# EAGLE design kawa_devboard (EAGLE 9.6.2)
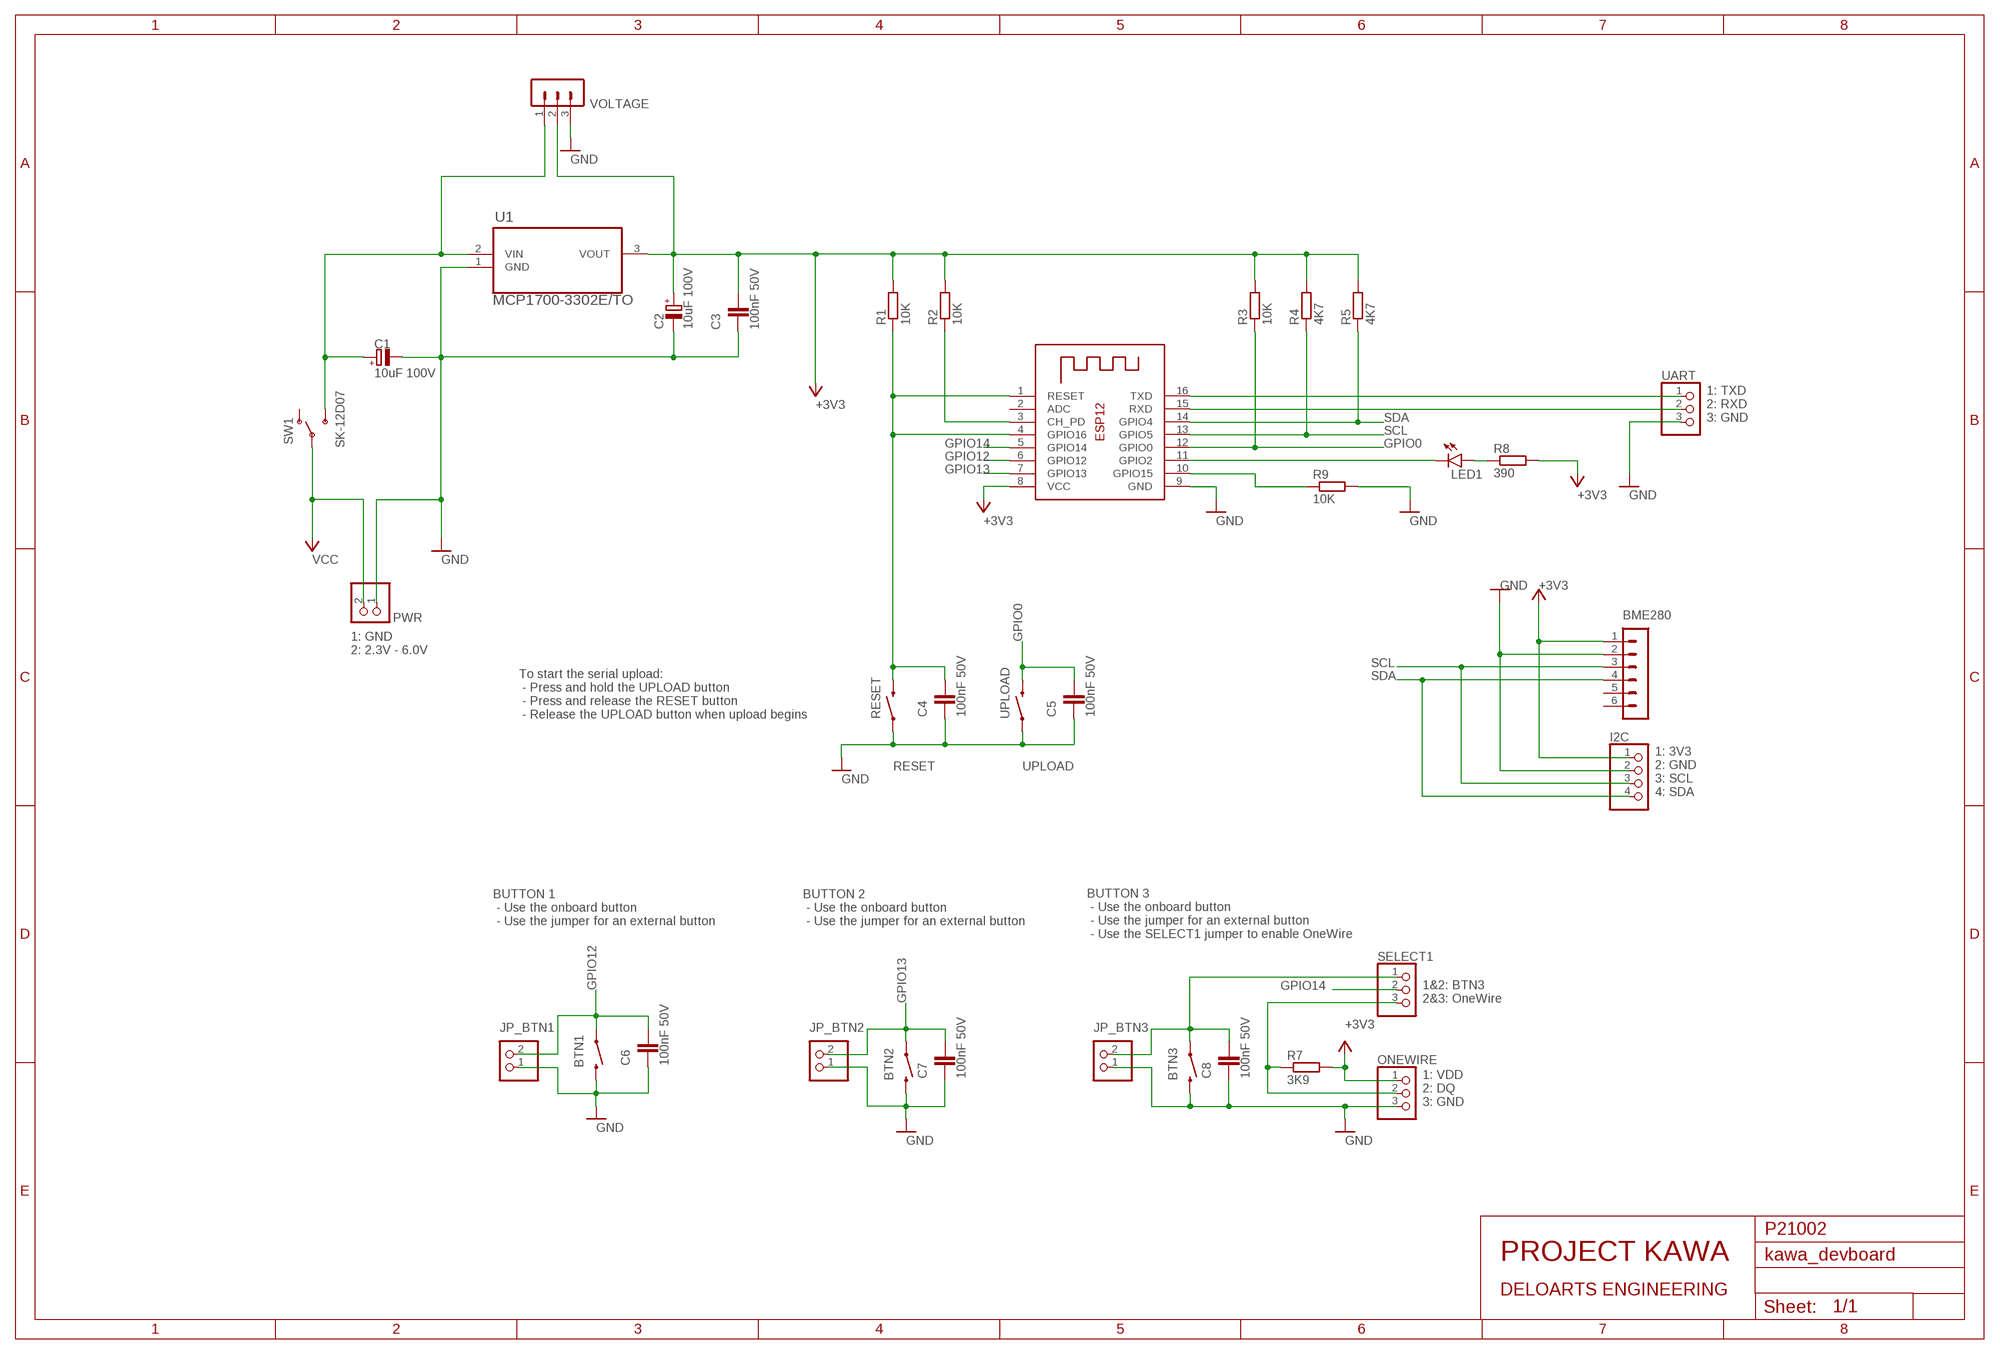
[diagram p0: schematic, sheet 1]

## Parts
BME280  MA06-1  [MA06-1]
BTN1  MOMENTARY-SWITCH-SPST-PTH-6.0MM  [TACTILE_SWITCH_PTH_6.0MM]
BTN2  MOMENTARY-SWITCH-SPST-PTH-6.0MM  [TACTILE_SWITCH_PTH_6.0MM]
BTN3  MOMENTARY-SWITCH-SPST-PTH-6.0MM  [TACTILE_SWITCH_PTH_6.0MM]
C1  10uF 100V  CPOL-EUE2-5  [E2-5]
C2  10uF 100V  CPOL-EUE2-5  [E2-5]
C3  100nF 50V  C2,5-3  [C2.5-3]
C4  100nF 50V  C2,5-3  [C2.5-3]
C5  100nF 50V  C2,5-3  [C2.5-3]
C6  100nF 50V  C2,5-3  [C2.5-3]
C7  100nF 50V  C2,5-3  [C2.5-3]
C8  100nF 50V  C2,5-3  [C2.5-3]
I2C  PINHD-1X4  [1X04]
JP_BTN1  PINHD-1X2/90  [1X02/90]
JP_BTN2  PINHD-1X2/90  [1X02/90]
JP_BTN3  PINHD-1X2/90  [1X02/90]
LED1  LEDSFH480  [SFH480]
ONEWIRE  PINHD-1X3/90  [1X03/90]
PWR  PINHD-1X2/90  [1X02/90]
R1  10K  R-EU_0204/7  [0204/7]
R2  10K  R-EU_0204/7  [0204/7]
R3  10K  R-EU_0204/7  [0204/7]
R4  4K7  R-EU_0204/7  [0204/7]
R5  4K7  R-EU_0204/7  [0204/7]
R7  3K9  R-EU_0204/7  [0204/7]
R8  390  R-EU_0204/7  [0204/7]
R9  10K  R-EU_0204/7  [0204/7]
RESET  MOMENTARY-SWITCH-SPST-PTH-6.0MM  [TACTILE_SWITCH_PTH_6.0MM]
SELECT1  PINHD-1X3  [1X03]
SW1  SK-12D07  [SK12SWITCH]
U1  MCP1700-3302E/TO  [TO127P254X495-3]
UART  PINHD-1X3  [1X03]
UPLOAD  MOMENTARY-SWITCH-SPST-PTH-6.0MM  [TACTILE_SWITCH_PTH_6.0MM]
VOLTAGE  MA03-1  [MA03-1]
X1  ESP-12  [ESP-12]

## Nets
+3V3: BME280.1 C2.+ C3.1 I2C.1 ONEWIRE.1 R1.2 R2.2 R3.2 R4.2 R5.2 R7.2 R8.2 U1.3(VOUT) VOLTAGE.2 X1.8(VCC)
BTN3: BTN3.1 C8.1 JP_BTN3.2 SELECT1.1
CH_PD: R2.1 X1.3(CH_PD)
DQ: ONEWIRE.2 R7.1 SELECT1.3
GND: BME280.2 BTN1.3 BTN2.3 BTN3.3 C1.- C2.- C3.2 C4.2 C5.2 C6.2 C7.2 C8.2 I2C.2 JP_BTN1.1 JP_BTN2.1 JP_BTN3.1 ONEWIRE.3 PWR.1 R9.2 RESET.1 U1.1(GND) UART.3 UPLOAD.1 VOLTAGE.3 X1.9(GND)
GPIO0: C5.1 R3.1 UPLOAD.3 X1.12(GPIO0)
GPIO2: LED1.K(C) X1.11(GPIO2)
GPIO12: BTN1.1 C6.1 JP_BTN1.2 X1.6(GPIO12)
GPIO13: BTN2.1 C7.1 JP_BTN2.2 X1.7(GPIO13)
GPIO14: SELECT1.2 X1.5(GPIO14)
GPIO15: R9.1 X1.10(GPIO15)
LED1: LED1.A R8.1
RST: C4.1 R1.1 RESET.3 X1.1(RESET) X1.4(GPIO16)
RXD: UART.2 X1.15(RXD)
SCL: BME280.3 I2C.3 R4.1 X1.13(GPIO5)
SDA: BME280.4 I2C.4 R5.1 X1.14(GPIO4)
TXD: UART.1 X1.16(TXD)
VCC: PWR.2 SW1.P2(P)
VIN: C1.+ SW1.IN(S) U1.2(VIN) VOLTAGE.1
Unconnected: BME280.5 BME280.6 SW1.P1(O) X1.2(ADC)

## Notes on the sheet
- 1: TXD
  2: RXD
  3: GND
- 1: GND
  2: 2.3V - 6.0V
- To start the serial upload:
   - Press and hold the UPLOAD button
   - Press and release the RESET button
   - Release the UPLOAD button when upload begins
- RESET | UPLOAD
- 1: 3V3
  2: GND
  3: SCL
  4: SDA
- BUTTON 1
   - Use the onboard button
   - Use the jumper for an external button
- BUTTON 2
   - Use the onboard button
   - Use the jumper for an external button
- BUTTON 3
   - Use the onboard button
   - Use the jumper for an external button
   - Use the SELECT1 jumper to enable OneWire
- 1&2: BTN3
  2&3: OneWire
- 1: VDD
  2: DQ
  3: GND
- P21002
- PROJECT KAWA
- DELOARTS ENGINEERING

## Library data of the parts
BME280 = con-lstb:MA06-1: PIN HEADER; OC_FARNELL: unknown; OC_NEWARK: unknown
BTN1-BTN3 RESET UPLOAD = SparkFun-Switches:MOMENTARY-SWITCH-SPST: Momentary Switch (Pushbutton) - SPST Normally-open (NO) SPST momentary switches (buttons, pushbuttons). Variants PTH-12MM - 12mm square, through-hole Momentary Pushbutton Switch - 12mm Square <https://www.sparkfun.com/products/9190> (COM-09190) PTH-6.0MM, PTH-6.0MM-KIT - 6.0mm square, through-hole Mini Pushbutton Switch <https://www.sparkfun.com/products/97> (COM-00097) KIT package intended for soldering kit's - only one side of pads' copper is exposed. PTH-RIGHT-ANGLE-KIT - Right-angle, through-hole Right Angle Tactile Button <https://www.sparkfun.com/products/10791> - Used on SparkFun BigTime Watch Kit <https://www.sparkfun.com/products/11734> SMD-12MM - 12mm square, surface-mount Tactile Button - SMD (12mm) <https://www.sparkfun.com/products/12993> (COM-12993) Used on SparkFun PicoBoard <https://www.sparkfun.com/products/11888> SMD-4.5MM - 4.5mm Square Trackball Switch Used on SparkFun Blackberry Trackballer Breakout <https://www.sparkfun.com/products/13169> SMD-4.6MMX2.8MM - 4.60mm x 2.80mm, surface mount Used on SparkFun SAMD21 Mini Breakout <https://www.sparkfun.com/products/13664> SMD-5.2MM, SMD-5.2-REDUNDANT - 5.2mm square, surface-mount Mini Pushbutton Switch - SMD <https://www.sparkfun.com/products/8720> (COM-08720) Used on Arduino Pro Mini <https://www.sparkfun.com/products/11114> REDUNDANT package connects both switch circuits together SMD-6.0X3.5MM - 6.0 x 3.5mm, surface mount Momentary Reset Switch SMD <https://www.sparkfun.com/products/8229> (COM-08229) SMD-6.2MM-TALL - 6.2mm square, surface mount Tactile Button - SMD (6mm) <https://www.sparkfun.com/products/12992> Used on SparkFun Digital Sandbox <https://www.sparkfun.com/products/12651> SMD-RIGHT-ANGLE - Right-angle, surface mount Used on SparkFun Block for Intel® Edison - Arduino <https://www.sparkfun.com/products/13036>; PROD_ID: SWCH-08441; SF_SKU: COM-00097
C1 C2 = rcl:CPOL-EU: POLARIZED CAPACITOR, European symbol; SPICEPREFIX: C
C3-C8 = capacitor-wima:C: CAPACITOR naming: grid - package width
I2C = pinhead:PINHD-1X4: PIN HEADER
JP_BTN1-JP_BTN3 PWR = pinhead:PINHD-1X2: PIN HEADER
LED1 = led:LED: LED OSRAM: - CHIPLED LG R971, LG N971, LY N971, LG Q971, LY Q971, LO R971, LY R971 LH N974, LH R974 LS Q976, LO Q976, LY Q976 LO Q996 - Hyper CHIPLED LW Q18S LB Q993, LB Q99A, LB R99A - SideLED LS A670, LO A670, LY A670, LG A670, LP A670 LB A673, LV A673, LT A673, LW A673 LH A674 LY A675 LS A676, LA A676, LO A676, LY A676, LW A676 LS A679, LY A679, LG A679 - Hyper Micro SIDELED® LS Y876, LA Y876, LO Y876, LY Y876 LT Y87S - SmartLED LW L88C, LW L88S LB L89C, LB L89S, LG L890 LS L89K, LO L89K, LY L89K LS L896, LA L896, LO L896, LY L896 - TOPLED LS T670, LO T670, LY T670, LG T670, LP T670 LSG T670, LSP T670, LSY T670, LOP T670, LYG T670 LG T671, LOG T671, LSG T671 LB T673, LV T673, LT T673, LW T673 LH T674 LS T676, LA T676, LO T676, LY T676, LB T676, LH T676, LSB T676, LW T676 LB T67C, LV T67C, LT T67C, LS T67K, LO T67K, LY T67K, LW E67C LS E67B, LA E67B, LO E67B, LY E67B, LB E67C, LV E67C, LT E67C LW T67C LS T679, LY T679, LG T679 LS T770, LO T770, LY T770, LG T770, LP T770 LB T773, LV T773, LT T773, LW T773 LH T774 LS E675, LA E675, LY E675, LS T675 LS T776, LA T776, LO T776, LY T776, LB T776 LHGB T686 LT T68C, LB T68C - Hyper Mini TOPLED® LB M676 - Mini TOPLED Santana® LG M470 LS M47K, LO M47K, LY M47K Source: http://www.osram.convergy.de LUXEON: - LUMILED® LXK2-PW12-R00, LXK2-PW12-S00, LXK2-PW14-U00, LXK2-PW14-V00 LXK2-PM12-R00, LXK2-PM12-S00, LXK2-PM14-U00 LXK2-PE12-Q00, LXK2-PE12-R00, LXK2-PE12-S00, LXK2-PE14-T00, LXK2-PE14-U00 LXK2-PB12-K00, LXK2-PB12-L00, LXK2-PB12-M00, LXK2-PB14-N00, LXK2-PB14-P00, LXK2-PB14-Q00 LXK2-PR12-L00, LXK2-PR12-M00, LXK2-PR14-Q00, LXK2-PR14-R00 LXK2-PD12-Q00, LXK2-PD12-R00, LXK2-PD12-S00 LXK2-PH12-R00, LXK2-PH12-S00 LXK2-PL12-P00, LXK2-PL12-Q00, LXK2-PL12-R00 Source: www.luxeon.com KINGBRIGHT: KA-3528ASYC Source: www.kingbright.com
ONEWIRE SELECT1 UART = pinhead:PINHD-1X3: PIN HEADER
R1-R5 R7-R9 = rcl:R-EU_: RESISTOR, European symbol; SPICEPREFIX: R
SW1 = custom:SK-12D07
U1 = MCP1700-3302E_TO:MCP1700-3302E/TO: IC LDO REG 250MA 5.0V Check prices <https://pricing.snapeda.com/parts/MCP1700-3302E/TO/Microchip%20Technology/view-part?ref=eda>; AVAILABILITY: Good; DESCRIPTION: IC REG LINEAR 3.3V 250MA TO92-3; MF: Microchip Technology; MP: MCP1700-3302E/TO; PACKAGE: None; PRICE: None; PURCHASE-URL: https://pricing.snapeda.com/search/part/MCP1700-3302E/TO/?ref=eda
VOLTAGE = con-lstb:MA03-1: PIN HEADER; OC_FARNELL: unknown; OC_NEWARK: unknown
X1 = adafruit:ESP-12

## Board
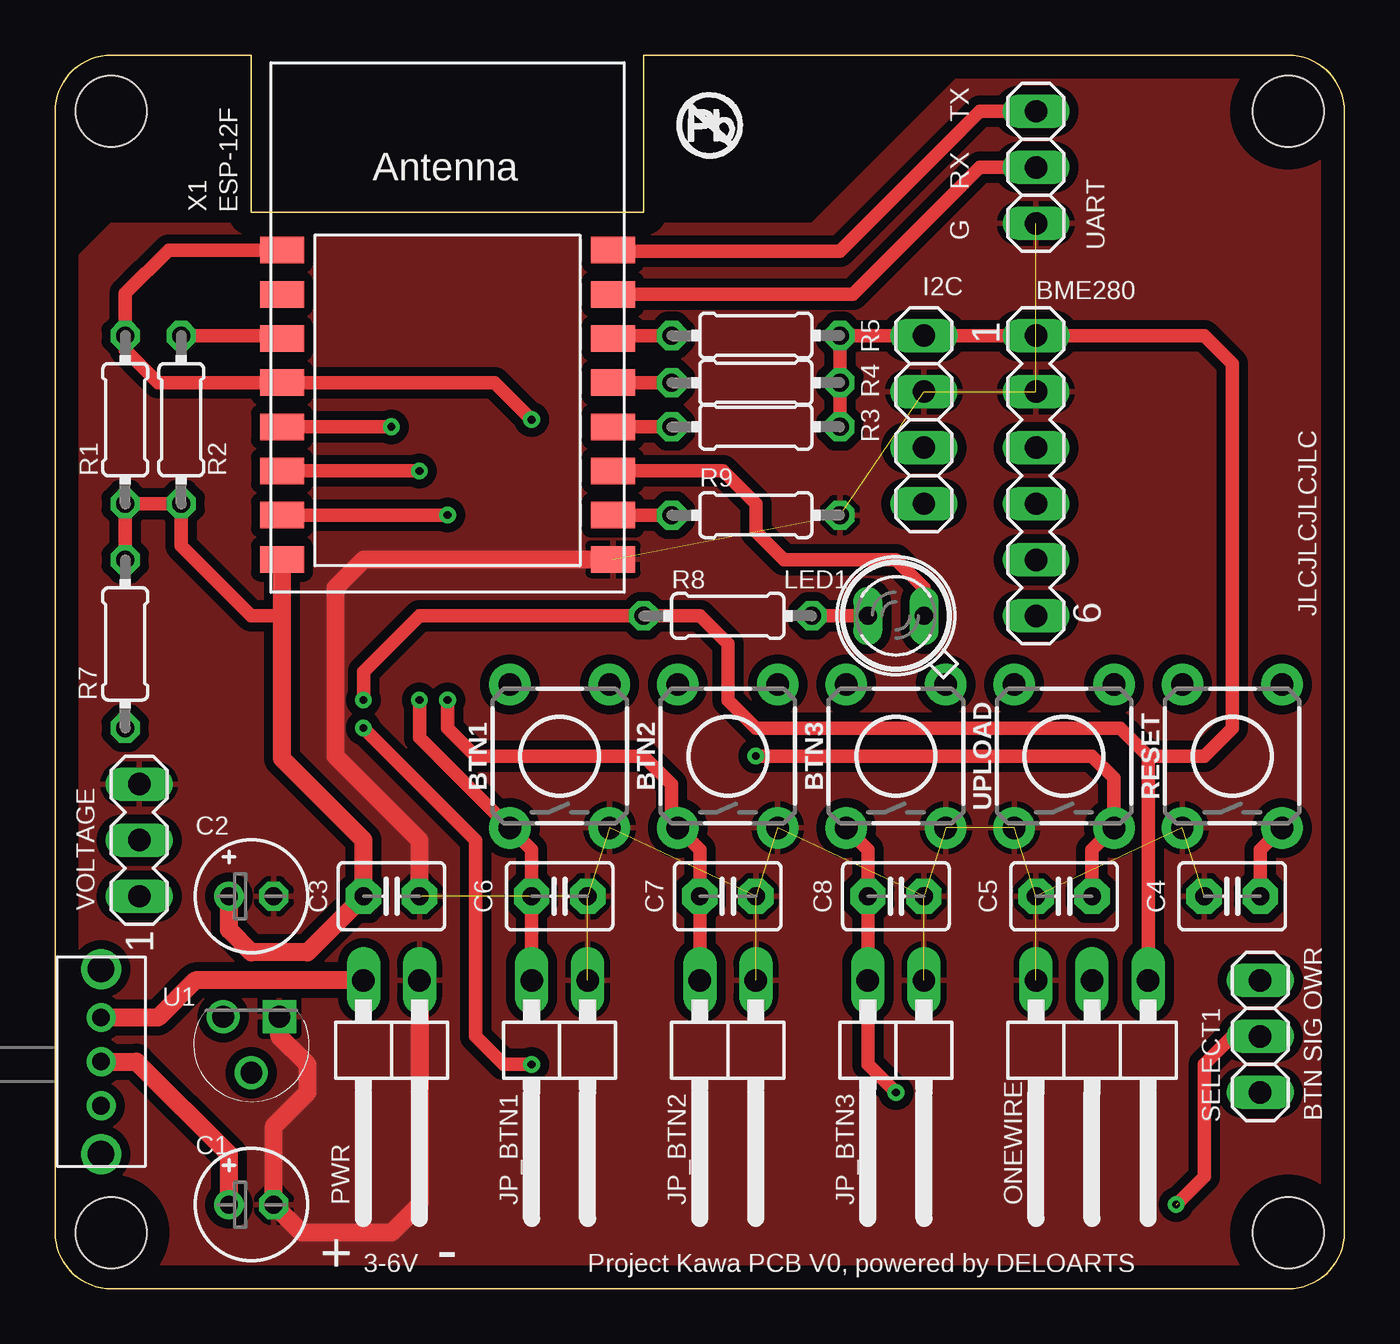
[diagram p1: board, top side]
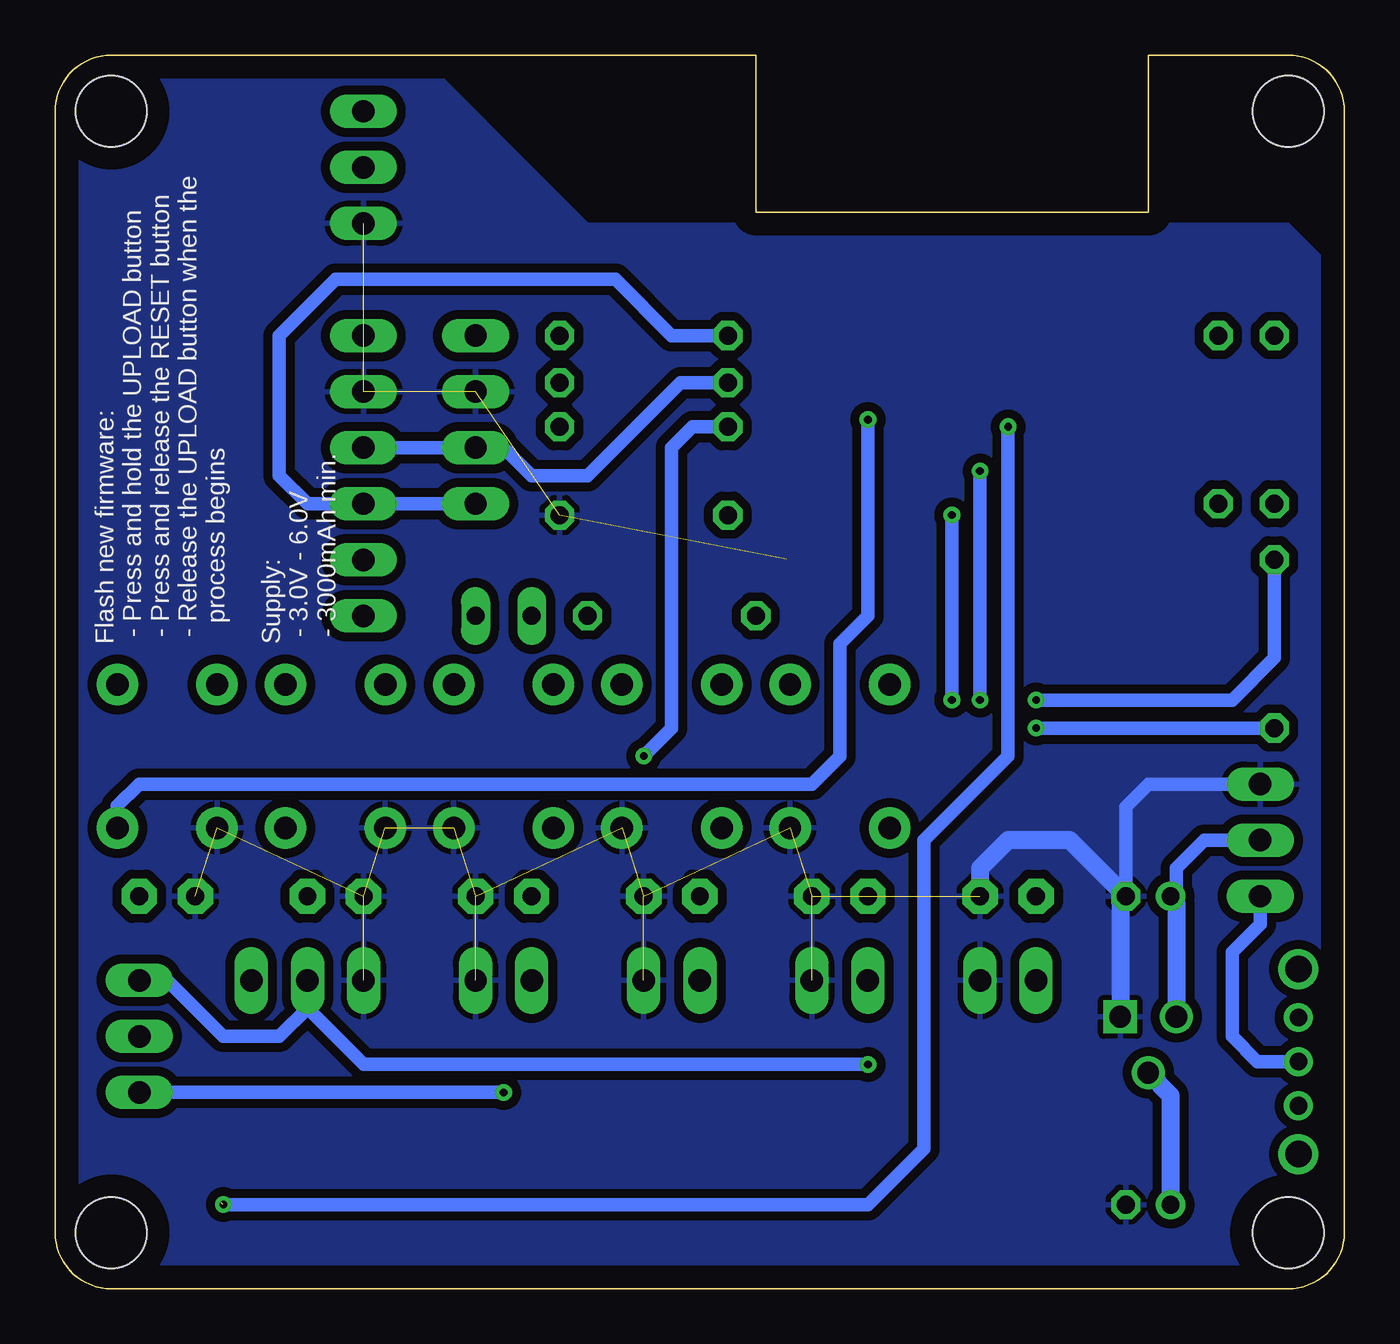
[diagram p2: board, bottom side, seen from below]

Size 58.42 x 55.88 mm. Coordinates in mm from the lower left corner, seen from the top.
Outline: 8.89,55.88 8.89,48.77 26.67,48.77 26.67,55.88 55.88,55.88 arc-90 58.42,53.34 58.42,2.54 arc-90 55.88,0 2.54,0 arc-90 0,2.54 0,53.34 arc-90 2.54,55.88 8.89,55.88
Copper layers (1*16): Top 0.035mm / dielectric 1.5mm / Bottom 0.035mm
Design rules "default": minimum track width 6mil, minimum drill 0.35mm, track to track 6mil, track to pad 6mil, pad to pad 6mil, via to via 6mil, smd to smd 6mil, copper to edge 40mil, drill to drill 6mil, minimum pad ring 10mil, minimum via ring 8mil, stop-mask expansion 4mil, vias tented up to drill 0mil, thermal gap 10mil
Holes 3.2 mm at 55.88,53.34 2.54,53.34 55.88,2.54 2.54,2.54

### Footprints (pad centres in the part's own frame; a part is rotated, then mirrored left to right if it is on the bottom)
MA06-1 = drill 1.016 long: 1 -6.35,0; 2 -3.81,0; 3 -1.27,0; 4 1.27,0; 5 3.81,0; 6 6.35,0
TACTILE_SWITCH_PTH_6.0MM = drill 1.016 pad 1.88: 1 -3.251,2.261; 2 3.251,2.261; 3 -3.251,-2.261; 4 3.251,-2.261
E2-5 = drill 0.813 pad 1.27: + -1.016,0 | drill 0.813 pad 1.27 octagon: - 1.016,0
C2.5-3 = drill 0.813 pad 1.6 octagon: 1 -1.27,0; 2 1.27,0
1X04 = drill 1.016 long: 1 -3.81,0; 2 -1.27,0; 3 1.27,0; 4 3.81,0
1X02/90 = drill 1.016 long: 1 -1.27,-3.81; 2 1.27,-3.81
SFH480 = drill 0.813 long: A 1.27,0; K -1.27,0
1X03/90 = drill 1.016 long: 1 -2.54,-3.81; 2 0,-3.81; 3 2.54,-3.81
0204/7 = drill 0.813 octagon: 1 -3.81,0; 2 3.81,0
1X03 = drill 1.016 long: 1 -2.54,0; 2 0,0; 3 2.54,0
SK12SWITCH = drill 0.8: IN 0,0; P1 0,2; P2 0,-2 | drill 1.2: PIN1 0,4.191; PIN2 0,-4.191
TO127P254X495-3 = drill 0.991 square: 1 -2.54,-2.54 | drill 0.991: 2 -1.27,0; 3 0,-2.54
MA03-1 = drill 1.016 long: 1 -2.54,0; 2 0,0; 3 2.54,0
ESP-12 = smd 2 x 1.2: 1 -7.5,4.5; 2 -7.5,2.5; 3 -7.5,0.5; 4 -7.5,-1.5; 5 -7.5,-3.5; 6 -7.5,-5.5; 7 -7.5,-7.5; 8 -7.5,-9.5; 9 7.5,-9.5; 10 7.5,-7.5; 11 7.5,-5.5; 12 7.5,-3.5; 13 7.5,-1.5; 14 7.5,0.5; 15 7.5,2.5; 16 7.5,4.5

### Placement (x,y rotation side)
BME280  44.45,36.83 270 top
BTN1  22.86,24.13 90 top
BTN2  30.48,24.13 90 top
BTN3  38.1,24.13 90 top
C1  8.89,3.81 0 top
C2  8.89,17.78 0 top
C3  15.24,17.78 0 top
C4  53.34,17.78 180 top
C5  45.72,17.78 180 top
C6  22.86,17.78 0 top
C7  30.48,17.78 0 top
C8  38.1,17.78 0 top
I2C  39.37,39.37 270 top
JP_BTN1  22.86,10.16 180 top
JP_BTN2  30.48,10.16 180 top
JP_BTN3  38.1,10.16 180 top
LED1  38.1,30.48 180 top
ONEWIRE  46.99,10.16 180 top
PWR  15.24,10.16 180 top
R1  3.17,39.37 270 top
R2  5.71,39.37 270 top
R3  31.75,39.05 0 top
R4  31.75,41.05 0 top
R5  31.75,43.18 0 top
R7  3.17,29.21 90 top
R8  30.48,30.48 180 top
R9  31.75,35.05 0 top
RESET  53.34,24.13 90 top
SELECT1  54.61,11.43 90 top
SW1  2.08,10.29 180 top
U1  7.62,9.78 180 top
U$1  [NO_PB_LOGO_0.120]  27.94,50.8 0 top
UART  44.45,50.8 270 top
UPLOAD  45.72,24.13 90 top
VOLTAGE  3.81,20.32 90 top
X1  17.78,42.55 0 top

### Tracks (layer width: path | path; a pad name or v marks a point on that pad's centre or on a via)
+3V3  (via drill 0.35)
  Top 0.61: X1.8 10.28,32.9 | 10.26,33.02 X1.8 | ONEWIRE.1 49.53,24.13 | 10.28,30.48 X1.8 | 10.28,30.48 8.89,30.48 5.71,33.66 R2.2 R1.2 R7.2 | 49.53,24.13 48.26,25.4 31.75,25.4 30.48,26.67 30.48,29.21 29.21,30.48 R8.2 16.51,30.48 13.97,27.94 v13.97,26.67 | 49.53,24.13 52.07,24.13 53.34,25.4 53.34,41.91 52.07,43.18 BME280.1 I2C.1 R5.2 R4.2 R3.2 | 10.28,30.48 10.28,24.01
  Top 0.813: C2.+ 7.87,16.26 8.89,15.24 11.43,15.24 C3.1 13.97,20.32 10.28,24.01 X1.8
  Bottom 0.61: C2.+ 7.62,18.03 7.62,19.05 6.35,20.32 VOLTAGE.2 | R7.2 3.17,28.57 5.08,26.67 v13.97,26.67
  Bottom 0.813: U1.3 7.62,17.53 C2.+
BTN3  (via drill 0.35)
  Top 0.61: BTN3.1 36.83,19.89 C8.1 JP_BTN3.2 36.83,10.16 v38.1,8.89
  Bottom 0.61: SELECT1.1 v38.1,8.89
CH_PD
  Top 0.61: X1.3 10.14,43.18 R2.1
DQ  (via drill 0.35)
  Top 0.61: v21.59,10.16 20.32,10.16 19.05,11.43 19.05,20.32 v13.97,25.4
  Bottom 0.61: 46.99,12.7 48.26,11.43 50.8,11.43 53.34,13.97 SELECT1.3 | ONEWIRE.2 46.99,12.7 | v21.59,10.16 44.45,10.16 46.99,12.7 | R7.1 v13.97,25.4
GND  (18 unrouted)
  Top 0.61: 16.51,12.7 PWR.1 16.51,11.43
  Top 0.813: PWR.1 16.51,3.81 15.24,2.54 11.18,2.54 C1.- 9.91,7.37 11.43,8.89 11.43,10.16 10.16,11.43 U1.1 | C3.2 16.51,20.32 12.7,24.13 12.7,31.75 13.99,33.05 X1.9
  Bottom 0.61: C2.- 9.91,21.84 8.89,22.86 VOLTAGE.3
  Bottom 0.813: U1.1 10.16,17.53 C2.- 12.45,20.32 15.24,20.32 16.51,19.05 C3.2
  pour Bottom (isolate 0.406): 0,0 0,45.72 2.54,48.26 34.29,48.26 41.91,55.88 58.42,55.88 58.42,0
  pour Top (isolate 0.406): 0,0 0,45.72 2.54,48.26 34.29,48.26 41.91,55.88 58.42,55.88 58.42,0
GPIO0  (via drill 0.35)
  Top 0.61: C5.1 46.99,19.89 UPLOAD.3 47.98,23.14 46.99,24.13 v31.75,24.13 | R3.1 X1.12
  Bottom 0.61: v31.75,24.13 30.48,25.4 30.48,38.1 29.54,39.05 R3.1
GPIO2
  Top 0.61: 25.5,36.83 X1.11 30.27,37.05 31.75,35.56 31.75,34.29 33.02,33.02 38.1,33.02 39.37,31.75 LED1.K
GPIO12  (via drill 0.35)
  Top 0.61: JP_BTN1.2 C6.1 21.59,19.89 BTN1.1 16.51,24.97 v16.51,26.67 | 10.06,36.83 X1.6 v16.51,37.05
  Bottom 0.61: v16.51,26.67 v16.51,37.05
GPIO13  (via drill 0.35)
  Top 0.61: JP_BTN2.2 C7.1 29.21,19.89 BTN2.1 27.94,21.16 27.94,22.86 26.67,24.13 19.05,24.13 17.78,25.4 v17.78,26.67 | v17.78,35.05 X1.7
  Bottom 0.61: v17.78,26.67 v17.78,35.05
GPIO14  (via drill 0.35)  (1 unrouted)
  Top 0.61: X1.5 v15.24,39.05 | SELECT1.2 53.34,11.43 52.07,10.16 52.07,5.08 50.89,3.9
  Bottom 0.61: v15.24,39.05 15.24,24.13 19.05,20.32 19.05,6.35 21.59,3.81 v50.8,3.81
GPIO15
  Top 0.61: X1.10 R9.1
LED1
  Top 0.61: R8.1 LED1.A
RST  (via drill 0.35)
  Top 0.61: C4.1 54.61,19.89 RESET.3 | 10.22,46.99 X1.1 5.13,47.05 3.17,45.09 R1.1 3.17,42.55 4.67,41.05 X1.4 19.91,41.05 v21.59,39.37
  Bottom 0.61: RESET.3 55.6,21.87 54.61,22.86 24.13,22.86 22.86,24.13 22.86,29.21 21.59,30.48 v21.59,39.37
RXD
  Top 0.61: X1.15 36.16,45.05 41.91,50.8 UART.2
SCL
  Top 0.61: X1.13 R4.1
  Bottom 0.61: BME280.3 I2C.3 38.1,38.1 36.83,36.83 34.29,36.83 30.07,41.05 R4.1
SDA
  Top 0.61: X1.14 25.41,43.18 R5.1
  Bottom 0.61: I2C.4 BME280.4 46.99,35.56 48.26,36.83 48.26,43.18 45.72,45.72 33.02,45.72 30.48,43.18 R5.1
TXD
  Top 0.61: X1.16 25.34,46.99 35.56,46.99 41.91,53.34 UART.1
VCC
  Top 0.813: PWR.2 6.35,13.97 4.67,12.29 SW1.P2
VIN
  Top 0.61: 5.68,8.29 7.87,6.1
  Top 0.813: SW1.IN 3.68,10.29 7.87,6.1 C1.+
  Bottom 0.61: VOLTAGE.1 3.81,16.51 5.08,15.24 5.08,11.43 3.94,10.29 SW1.IN
  Bottom 0.813: C1.+ 7.87,8.76 U1.2

### Text on the board
tNames: ESP-12F | G RX TX | JLCJLCJLCJLC | BTN SIG OWR | + | 3-6V | - | Project Kawa PCB V0, powered by DELOARTS
bNames: Flash new firmware: / - Press and hold the UPLOAD button / - Press and release the RESET button / - Release the UPLOAD button when the / process begins / / Supply: / - 3.0V - 6.0V / - 3000mAh min.